# EAGLE board NEOPUUTA (EAGLE 9.6.2), part 1 of 2
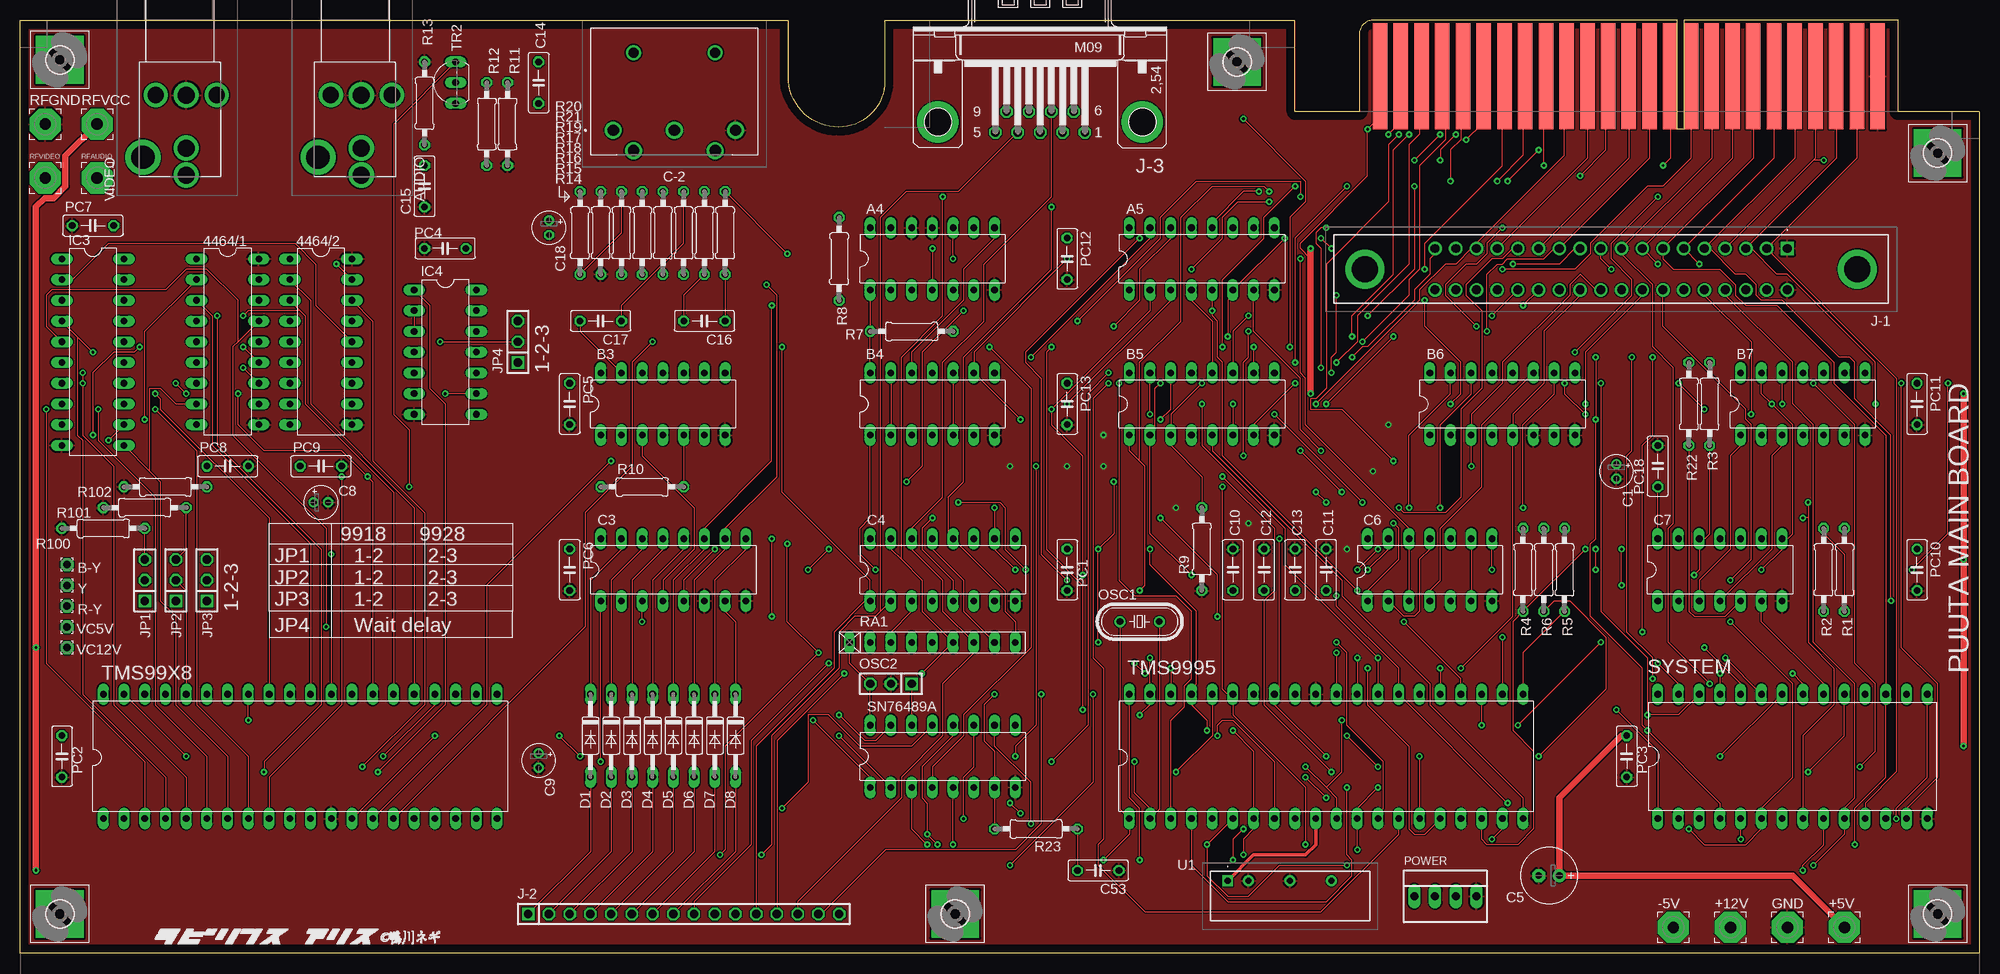
[diagram p1: board, top side]
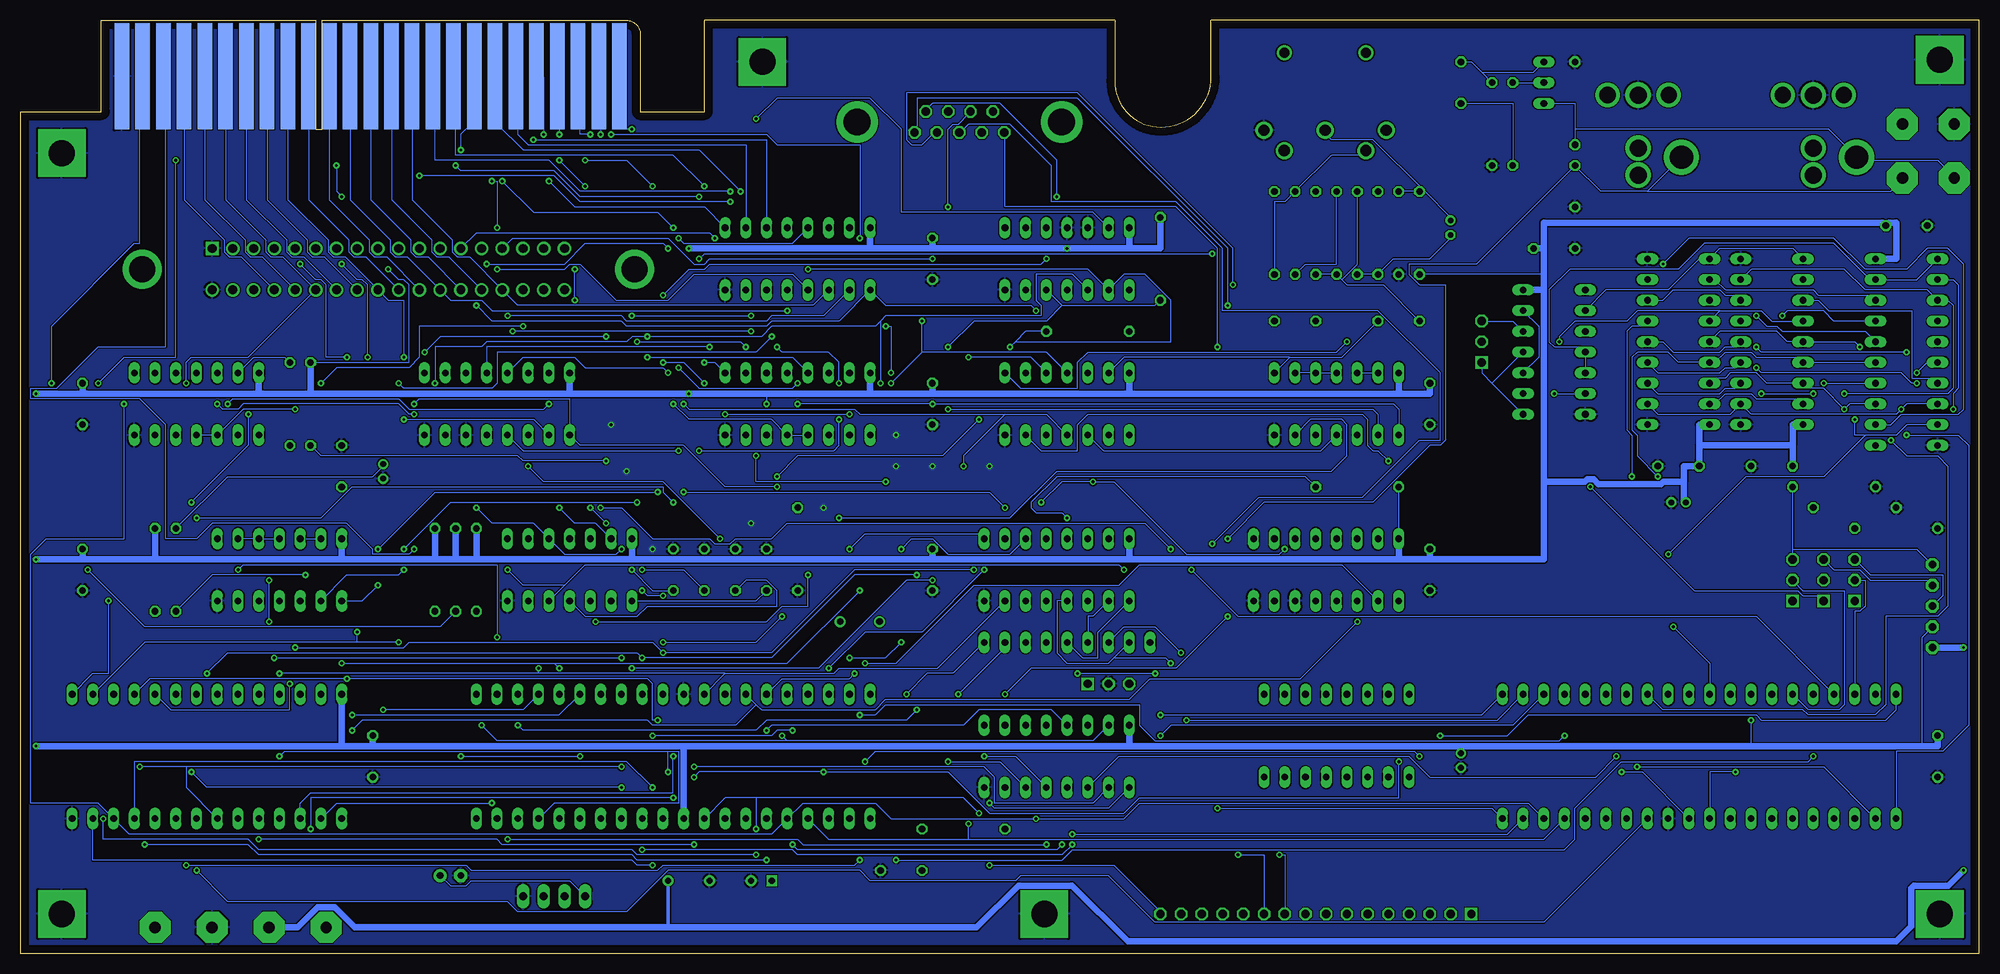
[diagram p2: board, bottom side, seen from below]

Size 240.03 x 114.3 mm. Coordinates in mm from the lower left corner, seen from the top.
Outline: 0,0 0,114.3 94.11,114.3 94.11,107.39 arc90 100.28,101.22 arc90 105.92,106.86 105.92,114.3 156.21,114.3 156.21,103.12 164.08,103.12 164.08,112.66 arc-90 165.72,114.3 203.07,114.3 203.07,100.97 203.84,100.97 203.84,114.3 230.12,114.3 230.12,103.12 240.03,103.12 240.03,0 0,0
Copper layers (1*16): Top 0.035mm / dielectric 1.5mm / Bottom 0.035mm
Design rules "default": minimum track width 6mil, minimum drill 0.35mm, track to track 6mil, track to pad 6mil, pad to pad 6mil, via to via 6mil, smd to smd 6mil, copper to edge 40mil, drill to drill 6mil, minimum pad ring 10mil, minimum via ring 8mil, stop-mask expansion 4mil, vias tented up to drill 0mil, thermal gap 10mil

## Footprints (pad centres in the part's own frame; a part is rotated, then mirrored left to right if it is on the bottom)
DIL18 = drill 0.813 long: 1 -10.16,-3.81; 2 -7.62,-3.81; 3 -5.08,-3.81; 4 -2.54,-3.81; 5 0,-3.81; 6 2.54,-3.81; 7 5.08,-3.81; 8 7.62,-3.81; 9 10.16,-3.81; 10 10.16,3.81; 11 7.62,3.81; 12 5.08,3.81; 13 2.54,3.81; 14 0,3.81; 15 -2.54,3.81; 16 -5.08,3.81; 17 -7.62,3.81; 18 -10.16,3.81
3,81/1,4 = drill 1.397 pad 3.81 octagon: 1 0,0
DIL14 = drill 0.813 long: 1 -7.62,-3.81; 2 -5.08,-3.81; 3 -2.54,-3.81; 4 0,-3.81; 5 2.54,-3.81; 6 5.08,-3.81; 7 7.62,-3.81; 8 7.62,3.81; 9 5.08,3.81; 10 2.54,3.81; 11 0,3.81; 12 -2.54,3.81; 13 -5.08,3.81; 14 -7.62,3.81
DIL16 = drill 0.813 long: 1 -8.89,-3.81; 2 -6.35,-3.81; 3 -3.81,-3.81; 4 -1.27,-3.81; 5 1.27,-3.81; 6 3.81,-3.81; 7 6.35,-3.81; 8 8.89,-3.81; 9 8.89,3.81; 10 6.35,3.81; 11 3.81,3.81; 12 1.27,3.81; 13 -1.27,3.81; 14 -3.81,3.81; 15 -6.35,3.81; 16 -8.89,3.81
973_1 = drill 2.08 pad 3.12: 1 0,0; 2 6.5,0; 3 9.8,0 | drill 2.87 pad 4.305: 4 7.62,-5.299 | drill 1.98 pad 2.97: 5 0,-3.745; 6 0,3.745
1,6/0,9 = drill 0.914 pad 1.6 octagon: 1 0,0
E1,8-4 = drill 0.711 pad 1.168: + -0.889,0 | drill 0.711 pad 1.168 octagon: - 0.889,0
E2,5-7 = drill 0.813 pad 1.6: + -1.27,0 | drill 0.813 pad 1.6 octagon: - 1.27,0
C050-025X075 = drill 0.813 octagon: 1 -2.54,0; 2 2.54,0
50PIN_CARDEDGE_2.54MM = smd 1.778 x 13: P$1 63.5,11.43; P$3 60.96,11.43; P$5 58.42,11.43; P$7 55.88,11.43; P$9 53.34,11.43; P$11 50.8,11.43; P$13 48.26,11.43; P$15 45.72,11.43; P$17 43.18,11.43; P$19 40.64,11.43; P$21 38.1,11.43; P$23 35.56,11.43; P$25 33.02,11.43; P$27 30.48,11.43; P$29 27.94,11.43; P$31 25.4,11.43; P$33 22.86,11.43; P$35 20.32,11.43; P$37 17.78,11.43; P$39 15.24,11.43; P$41 12.7,11.43; P$43 10.16,11.43; P$45 7.62,11.43; P$47 5.08,11.43; P$49 2.54,11.43 | smd 1.778 x 13 bottom: P$2 63.5,11.43; P$4 60.96,11.43; P$6 58.42,11.43; P$8 55.88,11.43; P$10 53.34,11.43; P$12 50.8,11.43; P$14 48.26,11.43; P$16 45.72,11.43; P$18 43.18,11.43; P$20 40.64,11.43; P$22 38.1,11.43; P$24 35.56,11.43; P$26 33.02,11.43; P$28 30.48,11.43; P$30 27.94,11.43; P$32 25.4,11.43; P$34 22.86,11.43; P$36 20.32,11.43; P$38 17.78,11.43; P$40 15.24,11.43; P$42 12.7,11.43; P$44 10.16,11.43; P$46 7.62,11.43; P$48 5.08,11.43; P$50 2.54,11.43
KCDX5SN = drill 1.4 pad 2.1: 1 0,0; 2 -7.5,0; 3 -15,0; 4 -2.5,2.5; 5 -12.5,2.5 | drill 1.24 pad 1.86: MH1 -2.5,-9.5; MH2 -12.5,-9.5
DO35-10 = drill 0.813 long: A 5.08,0; C -5.08,0
3,2-PAD-SQUARE = drill 3.2 pad 5.842 square: B3,2 0,0
DIL20 = drill 0.813 long: 1 -11.43,-3.81; 2 -8.89,-3.81; 3 -6.35,-3.81; 4 -3.81,-3.81; 5 -1.27,-3.81; 6 1.27,-3.81; 7 3.81,-3.81; 8 6.35,-3.81; 9 8.89,-3.81; 10 11.43,-3.81; 11 11.43,3.81; 12 8.89,3.81; 13 6.35,3.81; 14 3.81,3.81; 15 1.27,3.81; 16 -1.27,3.81; 17 -3.81,3.81; 18 -6.35,3.81; 19 -8.89,3.81; 20 -11.43,3.81
EBC18DRXH = drill 1.09 pad 1.635 square: A1 0,0 | drill 1.09 pad 1.635: A2 2.54,0; A3 5.08,0; A4 7.62,0; A5 10.16,0; A6 12.7,0; A7 15.24,0; A8 17.78,0; A9 20.32,0; A10 22.86,0; A11 25.4,0; A12 27.94,0; A13 30.48,0; A14 33.02,0; A15 35.56,0; A16 38.1,0; A17 40.64,0; A18 43.18,0; B1 0,5.08; B2 2.54,5.08; B3 5.08,5.08; B4 7.62,5.08; B5 10.16,5.08; B6 12.7,5.08; B7 15.24,5.08; B8 17.78,5.08; B9 20.32,5.08; B10 22.86,5.08; B11 25.4,5.08; B12 27.94,5.08; B13 30.48,5.08; B14 33.02,5.08; B15 35.56,5.08; B16 38.1,5.08; B17 40.64,5.08; B18 43.18,5.08 | drill 3.18 pad 4.77: MH1 -8.575,2.54; MH2 51.755,2.54
1X16 = drill 1.016 square: 1 -19.05,0 | drill 1.016 octagon: 2 -16.51,0; 3 -13.97,0; 4 -11.43,0; 5 -8.89,0; 6 -6.35,0; 7 -3.81,0; 8 -1.27,0; 9 1.27,0; 10 3.81,0; 11 6.35,0; 12 8.89,0; 13 11.43,0; 14 13.97,0; 15 16.51,0; 16 19.05,0
M09HP = drill 1.016 octagon: 1 -5.486,1.27; 2 -2.743,1.27; 3 0,1.27; 4 2.743,1.27; 5 5.486,1.27; 6 -4.115,-1.27; 7 -1.372,-1.27; 8 1.372,-1.27; 9 4.115,-1.27 | drill 3.302 pad 5.08: G1 -12.522,0; G2 12.522,0
1X03 = drill 1.016 square: 1 -2.54,0 | drill 1.016 octagon: 2 0,0; 3 2.54,0
HC49/S = drill 0.813: 1 -2.413,0; 2 2.413,0
22-23-2041 = drill 1 long: 1 -3.81,0; 2 -1.27,0; 3 1.27,0; 4 3.81,0
0207/10 = drill 0.813 octagon: 1 -5.08,0; 2 5.08,0
RN-9 = drill 0.813 long: 1 -10.16,0; 2 -7.62,0; 3 -5.08,0; 4 -2.54,0; 5 0,0; 6 2.54,0; 7 5.08,0; 8 7.62,0; 9 10.16,0
DIL28-6 = drill 0.813 long: 1 -16.51,-7.62; 2 -13.97,-7.62; 3 -11.43,-7.62; 4 -8.89,-7.62; 5 -6.35,-7.62; 6 -3.81,-7.62; 7 -1.27,-7.62; 8 1.27,-7.62; 9 3.81,-7.62; 10 6.35,-7.62; 11 8.89,-7.62; 12 11.43,-7.62; 13 13.97,-7.62; 14 16.51,-7.62; 15 16.51,7.62; 16 13.97,7.62; 17 11.43,7.62; 18 8.89,7.62; 19 6.35,7.62; 20 3.81,7.62; 21 1.27,7.62; 22 -1.27,7.62; 23 -3.81,7.62; 24 -6.35,7.62; 25 -8.89,7.62; 26 -11.43,7.62; 27 -13.97,7.62; 28 -16.51,7.62
DIL40 = drill 0.813 long: 1 -24.13,-7.62; 2 -21.59,-7.62; 3 -19.05,-7.62; 4 -16.51,-7.62; 5 -13.97,-7.62; 6 -11.43,-7.62; 7 -8.89,-7.62; 8 -6.35,-7.62; 9 -3.81,-7.62; 10 -1.27,-7.62; 11 1.27,-7.62; 12 3.81,-7.62; 13 6.35,-7.62; 14 8.89,-7.62; 15 11.43,-7.62; 16 13.97,-7.62; 17 16.51,-7.62; 18 19.05,-7.62; 19 21.59,-7.62; 20 24.13,-7.62; 21 24.13,7.62; 22 21.59,7.62; 23 19.05,7.62; 24 16.51,7.62; 25 13.97,7.62; 26 11.43,7.62; 27 8.89,7.62; 28 6.35,7.62; 29 3.81,7.62; 30 1.27,7.62; 31 -1.27,7.62; 32 -3.81,7.62; 33 -6.35,7.62; 34 -8.89,7.62; 35 -11.43,7.62; 36 -13.97,7.62; 37 -16.51,7.62; 38 -19.05,7.62; 39 -21.59,7.62; 40 -24.13,7.62
TO92-ECB = drill 0.813 long: B 2.54,0; C 0,0; E -2.54,0
MAU104 = drill 0.76 pad 1.303 square: 1 0,0 | drill 0.76 pad 1.303: 2 2.54,0; 4 7.62,0; 6 12.7,0

## Placement (x,y rotation side)
4464/1  [DIL18]  25.4,74.93 270 top
4464/2  [DIL18]  36.83,74.93 270 top
+5V  [3,81/1,4]  223.52,3.17 0 top
+12V  [3,81/1,4]  209.55,3.17 0 top
-5V  [3,81/1,4]  202.56,3.17 0 top
A4  74AC74N  [DIL14]  111.76,85.09 0 top
A5  74AC138N  [DIL16]  144.78,85.09 0 top
AUDIO  973  [973_1]  41.78,105.16 270 top
B3  74AC00N  [DIL14]  78.74,67.31 0 top
B4  74ACT32N  [DIL14]  111.76,67.31 0 top
B5  74AC138N  [DIL16]  144.78,67.31 0 top
B6  74AC138N  [DIL16]  181.61,67.31 0 top
B7  74LS107N  [DIL14]  218.44,67.31 0 top
B-Y  [1,6/0,9]  5.71,47.62 270 top
C1  47uF  [E1,8-4]  195.58,59.05 270 top
C3  74AC138N  [DIL16]  80.01,46.99 0 top
C4  74AC251N  [DIL16]  113.03,46.99 0 top
C5  100uF  [E2,5-7]  187.32,9.53 180 top
C6  74ALS00N  [DIL14]  172.72,46.99 0 top
C7  74AC00N  [DIL14]  208.28,46.99 0 top
C8  10uF  [E1,8-4]  36.83,55.24 0 top
C9  10uF  [E1,8-4]  63.5,23.62 270 top
C10  103  [C050-025X075]  148.59,46.99 90 top
C11  103  [C050-025X075]  160.02,46.99 90 top
C12  103  [C050-025X075]  152.4,46.99 90 top
C13  103  [C050-025X075]  156.21,46.99 90 top
C14  331  [C050-025X075]  63.5,106.68 270 top
C15  103  [C050-025X075]  49.53,93.98 90 top
C16  103  [C050-025X075]  83.82,77.47 180 top
C17  471  [C050-025X075]  71.12,77.47 180 top
C18  10uF  [E1,8-4]  64.77,88.9 270 top
C53  104  [C050-025X075]  132.08,10.16 180 top
C-1  50PI_CARDEDGE_2.54MM_MOTHER  [50PIN_CARDEDGE_2.54MM]  164.08,96.01 0 top
C-2  KCDX-5S-N  [KCDX5SN]  72.64,100.84 180 top
D1  1N4148DO35-10  [DO35-10]  69.85,26.67 270 top
D2  1N4148DO35-10  [DO35-10]  72.39,26.67 270 top
D3  1N4148DO35-10  [DO35-10]  74.93,26.67 270 top
D4  1N4148DO35-10  [DO35-10]  77.47,26.67 270 top
D5  1N4148DO35-10  [DO35-10]  80.01,26.67 270 top
D6  1N4148DO35-10  [DO35-10]  82.55,26.67 270 top
D7  1N4148DO35-10  [DO35-10]  85.09,26.67 270 top
D8  1N4148DO35-10  [DO35-10]  87.63,26.67 270 top
GND  [3,81/1,4]  216.53,3.17 0 top
H1  MOUNT-PAD-SQUARE3.2  [3,2-PAD-SQUARE]  234.95,98.04 0 top
H2  MOUNT-PAD-SQUARE3.2  [3,2-PAD-SQUARE]  149.1,109.22 0 top
H3  MOUNT-PAD-SQUARE3.2  [3,2-PAD-SQUARE]  4.83,109.47 0 top
H4  MOUNT-PAD-SQUARE3.2  [3,2-PAD-SQUARE]  234.95,4.83 0 top
H5  MOUNT-PAD-SQUARE3.2  [3,2-PAD-SQUARE]  4.83,4.83 0 top
H6  MOUNT-PAD-SQUARE3.2  [3,2-PAD-SQUARE]  114.55,4.83 0 top
IC3  74HC244N  [DIL20]  8.89,73.66 270 top
IC4  74HC04N  [DIL14]  52.07,73.66 270 top
J-1  EBC18DRXH  [EBC18DRXH]  216.53,86.36 180 top
J-2  [1X16]  81.28,4.83 0 top
J-3  [M09HP]  124.97,101.85 180 top
JP1  [1X03]  15.24,45.72 90 top
JP2  [1X03]  19.05,45.72 90 top
JP3  [1X03]  22.86,45.72 90 top
JP4  [1X03]  60.96,74.93 90 top
OSC1  10.738MHz  [HC49/S]  137.16,40.64 180 top
OSC2  [1X03]  106.68,33.02 180 top
PC1  [C050-025X075]  128.27,46.99 270 top
PC2  [C050-025X075]  5.08,24.13 270 top
PC3  [C050-025X075]  196.85,24.13 270 top
PC4  [C050-025X075]  52.07,86.36 180 top
PC5  [C050-025X075]  67.31,67.31 270 top
PC6  [C050-025X075]  67.31,46.99 270 top
PC7  [C050-025X075]  8.89,89.15 180 top
PC8  [C050-025X075]  25.4,59.69 0 top
PC9  [C050-025X075]  36.83,59.69 0 top
PC10  [C050-025X075]  232.41,46.99 270 top
PC11  [C050-025X075]  232.41,67.31 270 top
PC12  [C050-025X075]  128.27,85.09 270 top
PC13  [C050-025X075]  128.27,67.31 270 top
PC18  471  [C050-025X075]  200.66,59.69 90 top
POWER  22-23-2041  [22-23-2041]  174.62,6.99 0 top
R1  103  [0207/10]  223.52,46.99 90 top
R2  561  [0207/10]  220.98,46.99 90 top
R3  562  [0207/10]  207.01,67.31 90 top
R4  103  [0207/10]  184.15,46.99 90 top
R5  103  [0207/10]  189.23,46.99 90 top
R6  103  [0207/10]  186.69,46.99 90 top
R7  102  [0207/10]  109.22,76.2 180 top
R8  562  [0207/10]  100.33,85.09 90 top
R9  [0207/10]  144.78,49.53 90 top
R10  222  [0207/10]  76.2,57.15 0 top
R11  822  [0207/10]  59.69,101.6 270 top
R12  822  [0207/10]  57.15,101.6 270 top
R13  822  [0207/10]  49.53,104.14 90 top
R14  102  [0207/10]  86.36,88.27 90 top
R15  102  [0207/10]  83.82,88.27 90 top
R16  562  [0207/10]  81.28,88.27 90 top
R17  561  [0207/10]  76.2,88.27 90 top
R18  332  [0207/10]  78.74,88.27 90 top
R19  103  [0207/10]  73.66,88.27 90 top
R20  562  [0207/10]  68.58,88.27 90 top
R21  103  [0207/10]  71.12,88.27 90 top
R22  103  [0207/10]  204.47,67.31 90 top
R23  10  [0207/10]  124.46,15.24 180 top
R100  [0207/10]  10.16,52.07 0 top
R101  [0207/10]  15.24,54.61 0 top
R102  [0207/10]  17.78,57.15 0 top
R-Y  [1,6/0,9]  5.71,42.55 270 top
RA1  104  [RN-9]  111.76,38.1 0 top
RFAUDIO  [3,81/1,4]  9.4,95 0 top
RFGND  [3,81/1,4]  3.05,101.6 0 top
RFVCC  [3,81/1,4]  9.4,101.6 0 top
RFVIDEO  [3,81/1,4]  3.05,95 0 top
SN76489A  [DIL16]  113.03,24.13 0 top
SYSTEM  [DIL28-6]  217.17,24.13 0 top
TMS99X8  [DIL40]  34.29,24.13 0 top
TMS9995  [DIL40]  160.02,24.13 0 top
TR2  [TO92-ECB]  53.34,106.68 90 top
U1  MAU104  [MAU104]  147.96,8.89 0 top
VC5V  [1,6/0,9]  5.71,40.01 0 top
VC12V  [1,6/0,9]  5.71,37.47 0 top
VIDEO  973  [973_1]  20.32,105.16 270 top
Y  [1,6/0,9]  5.71,45.09 270 top